# Altium schematic sheet 纸飞机.SchDoc
size A4
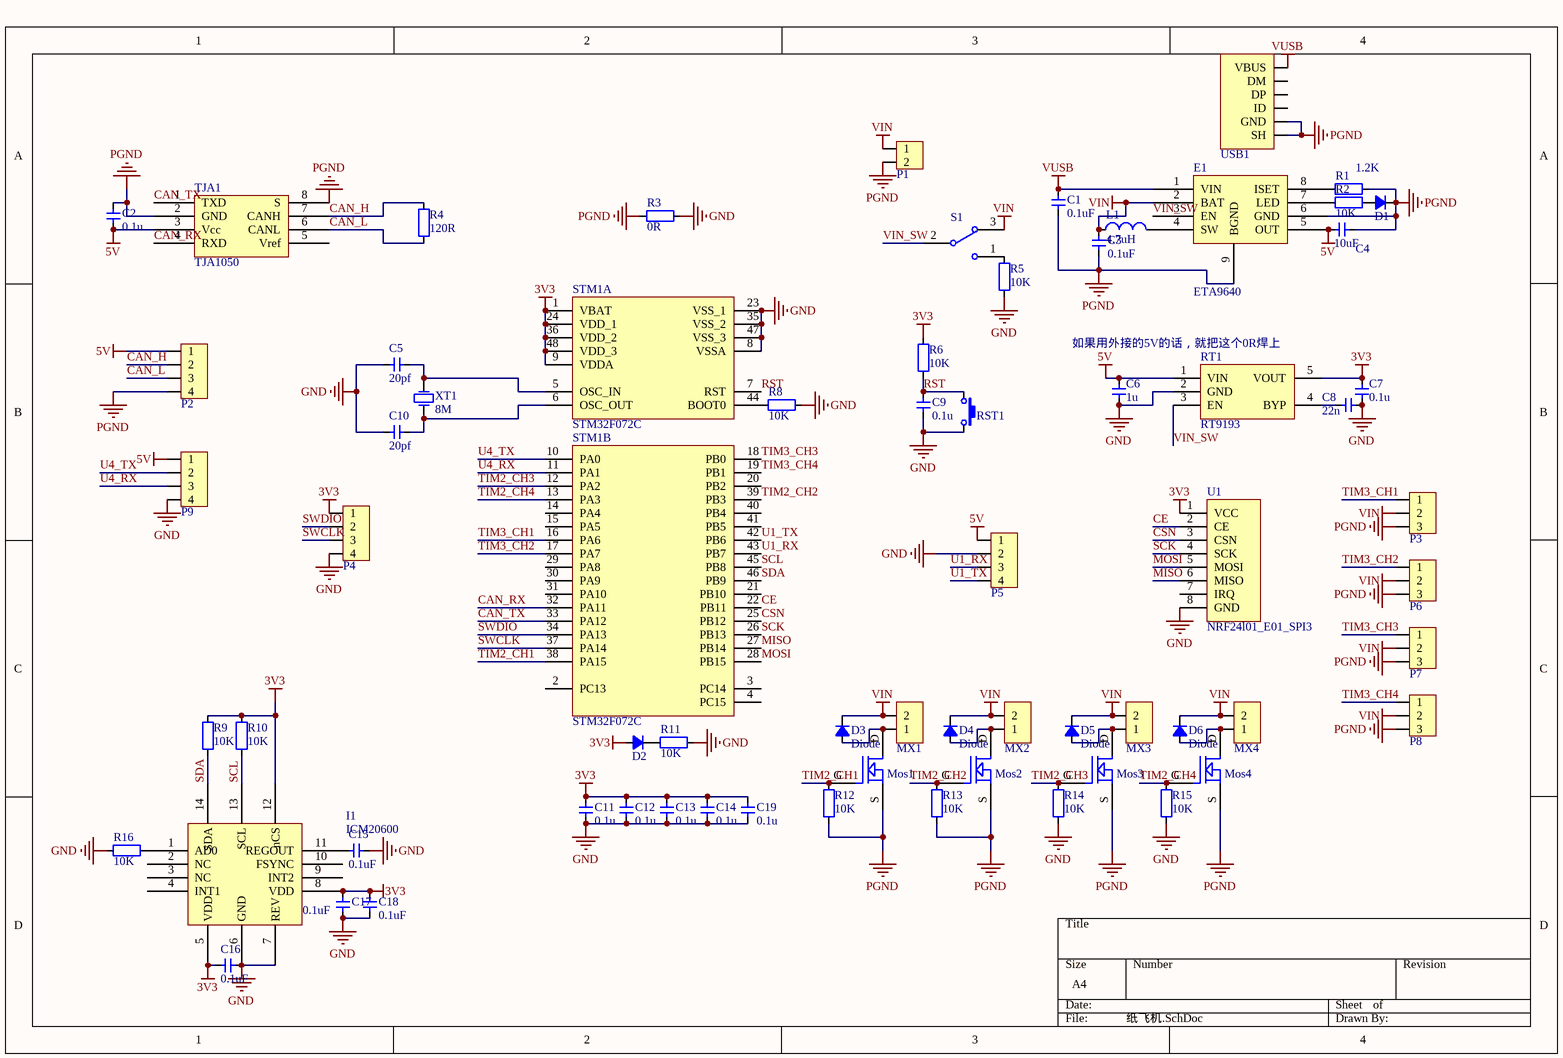
[diagram p0: 纸飞机.SchDoc]

## Parts
C1  value 0.1uF  [CAP_0603]  (hidden comment: Cap_0603)
C2  value 0.1u  [CAP_0603]  (hidden comment: Cap_0603)
C3  value 0.1uF  [CAP_0603]  (hidden comment: Cap_0603)
C4  value 10uF  [CAP_0603]  (hidden comment: Cap_0603)
C5  value 20pf  [CAP_0603]  (hidden comment: Cap_0603)
C6  value 1u  [CAP_0603]  (hidden comment: Cap_0603)
C7  value 0.1u  [CAP_0603]  (hidden comment: Cap_0603)
C8  value 22n  [CAP_0603]  (hidden comment: Cap_0603)
C9  value 0.1u  [CAP_0603]  (hidden comment: Cap_0603)
C10  value 20pf  [CAP_0603]  (hidden comment: Cap_0603)
C11  value 0.1u  [CAP_0603]  (hidden comment: Cap_0603)
C12  value 0.1u  [CAP_0603]  (hidden comment: Cap_0603)
C13  value 0.1u  [CAP_0603]  (hidden comment: Cap_0603)
C14  value 0.1u  [CAP_0603]  (hidden comment: Cap_0603)
C15  value 0.1uF  [CAP_0603]  (hidden comment: Cap_0603)
C16  value 0.1uF  [CAP_0603]  (hidden comment: Cap_0603)
C17  value 0.1uF  [CAP_0603]  (hidden comment: Cap_0603)
C18  value 0.1uF  [CAP_0603]  (hidden comment: Cap_0603)
C19  value 0.1u  [CAP_0603]  (hidden comment: Cap_0603)
D1  D_0805  [LED_0805_YELLOW]  (value not drawn)
D2  D_0805  [LED_0805_YELLOW]  (value not drawn)
D3  Diode  [LED_0805_RED]
D4  Diode  [LED_0805_RED]
D5  Diode  [LED_0805_RED]
D6  Diode  [LED_0805_RED]
E1  ETA9640  [SOP_E150_8 -with_PADs]
I1  ICM20600  [ICM20600]
L1  value 4.7uH  [IND_CD32]  (hidden comment: Ind_CD32)
Mos1  MOSFET N  [Nmos_SOT23]  (value not drawn)
Mos2  MOSFET N  [Nmos_SOT23]  (value not drawn)
Mos3  MOSFET N  [Nmos_SOT23]  (value not drawn)
Mos4  MOSFET N  [Nmos_SOT23]  (value not drawn)
MX1  MX1.25_2P  [MX1.25_S90_2P]  (value not drawn)
MX2  MX1.25_2P  [MX1.25_S90_2P]  (value not drawn)
MX3  MX1.25_2P  [MX1.25_S90_2P]  (value not drawn)
MX4  MX1.25_2P  [MX1.25_S90_2P]  (value not drawn)
P1  HDR1x2_2.54  [HDR1X2_2.54_180]  (value not drawn)
P2  HDR1x4_2.54  [1.25X4_SMT]  (value not drawn)
P3  HDR1x3_2.54  [1.25X3_SMT]  (value not drawn)
P4  HDR1x4_2.54  [HDR1x4_2.54_180]  (value not drawn)
P5  HDR1x4_2.54  [HDR1x4_2.54_180]  (value not drawn)
P6  HDR1x3_2.54  [1.25X3_SMT]  (value not drawn)
P7  HDR1x3_2.54  [1.25X3_SMT]  (value not drawn)
P8  HDR1x3_2.54  [1.25X3_SMT]  (value not drawn)
P9  HDR1x4_2.54  [1.25X4_SMT]  (value not drawn)
R1  value 1.2K  [RES_0603]  (hidden comment: Res_0603)
R2  value 10K  [RES_0603]  (hidden comment: Res_0603)
R3  value 0R  [RES_0603]  (hidden comment: Res_0603)
R4  value 120R  [RES_0603]  (hidden comment: Res_0603)
R5  value 10K  [RES_0603]  (hidden comment: Res_0603)
R6  value 10K  [RES_0603]  (hidden comment: Res_0603)
R8  value 10K  [RES_0603]  (hidden comment: Res_0603)
R9  value 10K  [RES_0603]  (hidden comment: Res_0603)
R10  value 10K  [RES_0603]  (hidden comment: Res_0603)
R11  value 10K  [RES_0603]  (hidden comment: Res_0603)
R12  value 10K  [RES_0603]  (hidden comment: Res_0603)
R13  value 10K  [RES_0603]  (hidden comment: Res_0603)
R14  value 10K  [RES_0603]  (hidden comment: Res_0603)
R15  value 10K  [RES_0603]  (hidden comment: Res_0603)
R16  value 10K  [RES_0603]  (hidden comment: Res_0603)
RST1  ButtonTACT_3x4x2_180  [ButtonTACT_3x4x2_180H]  (value not drawn)
RT1  RT9193  [SOT23-5]
S1  SwitchSPDT_2.8x6.6_90  [SwitchSPDT_2.8X6.6_90]  (value not drawn)
STM1  STM32F072C  [LQFP_P0.5_48]  (parts A,B of 2)
TJA1  TJA1050  [SOP_E150_8]
U1  NRF24l01_E01_SPI3  [E01-ML01SP2]
USB1  USB_Micro  [USB_Micro-AB]  (value not drawn)
XT1  value 8M  [XT_5032_2]  (hidden comment: XTAL_5032_2P)

## Nets
3V3: C7.2 C11.2 C12.2 C13.2 C14.2 C16.2 C17.1 C18.1 C19.2 D2.1(A) I1.5(VDD) I1.8(VDD) I1.12(nCS) P4.1 R6.2 R9.1 R10.1 RT1.5(VOUT) STM1.1(VBAT) STM1.9(VDDA) STM1.24(VDD_1) STM1.36(VDD_2) STM1.48(VDD_3) U1.1(VCC)
5V: C2.1 C4.1 C6.2 E1.5(OUT) P2.1 P5.1 P9.1 RT1.1(VIN) TJA1.3(Vcc)
GND: C5.1 C6.1 C7.1 C8.1 C9.1 C10.1 C11.1 C12.1 C13.1 C14.1 C15.2 C16.1 C17.2 C18.2 C19.1 I1.6(GND) I1.7(REV) P4.4 P5.2 P9.4 R3.2 R5.1 R8.1 R11.2 R14.2 R15.2 R16.1 RST1.2 RT1.2(GND) STM1.8(VSSA) STM1.23(VSS_1) STM1.35(VSS_2) STM1.47(VSS_3) U1.8(GND)
PGND: C1.2 C2.2 C3.2 C4.2 D1.2(K) E1.6(GND) E1.9(BGND) Mos1.S Mos2.S Mos3.S Mos4.S P1.2 P2.4 P3.3 P6.3 P7.3 P8.3 R1.1 R3.1 R12.2 R13.2 TJA1.2(GND) TJA1.8(S) USB1.0(SH) USB1.5(GND)
VIN: C3.1 D3.2(K) D4.2(K) D5.2(K) D6.2(K) E1.2(BAT) L1.1 MX1.2 MX2.2 MX3.2 MX4.2 P1.1 P3.2 P6.2 P7.2 P8.2 S1.3
VUSB: C1.1 E1.1(VIN) USB1.1(VBUS)
CAN_H: P2.2 R4.2 TJA1.7(CANH)
CAN_L: P2.3 R4.1 TJA1.6(CANL)
CAN_RX: STM1.32(PA11) TJA1.4(RXD)
CAN_TX: STM1.33(PA12) TJA1.1(TXD)
CE: STM1.22(PB11) U1.2(CE)
CSN: STM1.25(PB12) U1.3(CSN)
MISO: STM1.27(PB14) U1.6(MISO)
MOSI: STM1.28(PB15) U1.5(MOSI)
RST: C9.2 R6.1 RST1.1 STM1.7(RST)
SCK: STM1.26(PB13) U1.4(SCK)
SCL: I1.13(SCL) R10.2 STM1.45(PB8)
SDA: I1.14(SDA) R9.2 STM1.46(PB9)
SWCLK: P4.3 STM1.37(PA14)
SWDIO: P4.2 STM1.34(PA13)
TIM2_CH1: Mos1.G R12.1 STM1.38(PA15)
TIM2_CH2: Mos2.G R13.1 STM1.39(PB3)
TIM2_CH3: Mos3.G R14.1 STM1.12(PA2)
TIM2_CH4: Mos4.G R15.1 STM1.13(PA3)
TIM3_CH1: P3.1 STM1.16(PA6)
TIM3_CH2: P6.1 STM1.17(PA7)
TIM3_CH3: P7.1 STM1.18(PB0)
TIM3_CH4: P8.1 STM1.19(PB1)
U1_RX: P5.3 STM1.43(PB7)
U1_TX: P5.4 STM1.42(PB6)
U4_RX: P9.3 STM1.11(PA1)
U4_TX: P9.2 STM1.10(PA0)
VIN_SW: E1.3(EN) RT1.3(EN) S1.2
NetC5_2: C5.2 STM1.5(OSC_IN) XT1.2(OSC2)
NetC8_2: C8.2 RT1.4(BYP)
NetC10_2: C10.2 STM1.6(OSC_OUT) XT1.1(OSC1)
NetC15_1: C15.1 I1.11(REGOUT)
NetD1_1: D1.1(A) R2.1
NetD2_2: D2.2(K) R11.1
NetD3_1: D3.1(A) Mos1.D MX1.1
NetD4_1: D4.1(A) Mos2.D MX2.1
NetD5_1: D5.1(A) Mos3.D MX3.1
NetD6_1: D6.1(A) Mos4.D MX4.1
NetE1_4: E1.4(SW) L1.2
NetE1_7: E1.7(LED) R2.2
NetE1_8: E1.8(ISET) R1.2
NetI1_1: I1.1(AD0) R16.2
NetR5_2: R5.2 S1.1
NetR8_2: R8.2 STM1.44(BOOT0)

Not connected (* = marked no-connect by the designer): I1 2(NC) 3(NC) 4(INT1) 9(INT2) 10(FSYNC); STM1 2(PC13) 3(PC14) 4(PC15) 14(PA4) 15(PA5) 20(PB2) 21(PB10) 29(PA8) 30(PA9) 31(PA10) 40(PB4) 41(PB5); TJA1 5(Vref); U1 7(IRQ); USB1 2(DM) 3(DP) 4(ID)

## Notes on the sheet
- 如果用外接的5V的话，就把这个0R焊上

## Library data of the parts
C1-C19 = Cap_0603: Capacitor
L1 = Ind_CD32: Inductor
Mos1-Mos4 = MOSFET N: MOS SOT23
MX1-MX4 = MX1.25_2P: MX
P1 = HDR1x2_2.54: Header
P2 P4 P5 P9 = HDR1x4_2.54: Header
P3 P6-P8 = HDR1x3_2.54: Header
R1-R6 R8-R16 = Res_0603: Resistor
RST1 = ButtonTACT_3x4x2_180: Button
RT1 = RT9193: Power
S1 = SwitchSPDT_2.8x6.6_90: Switch
STM1 = STM32F103C: MCU
U1 = NRF24l01_E01_SPI2
USB1 = USB_Micro: USB
XT1 = XTAL_5032_2P: Crystal Oscillator